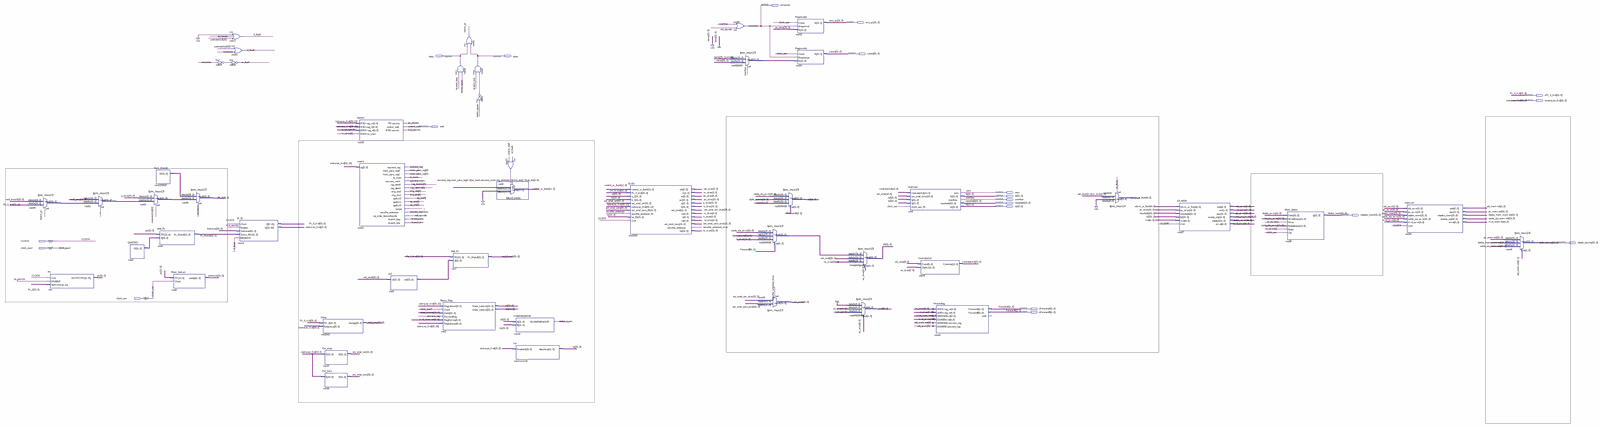
[diagram p0: schematic sheet, whole]
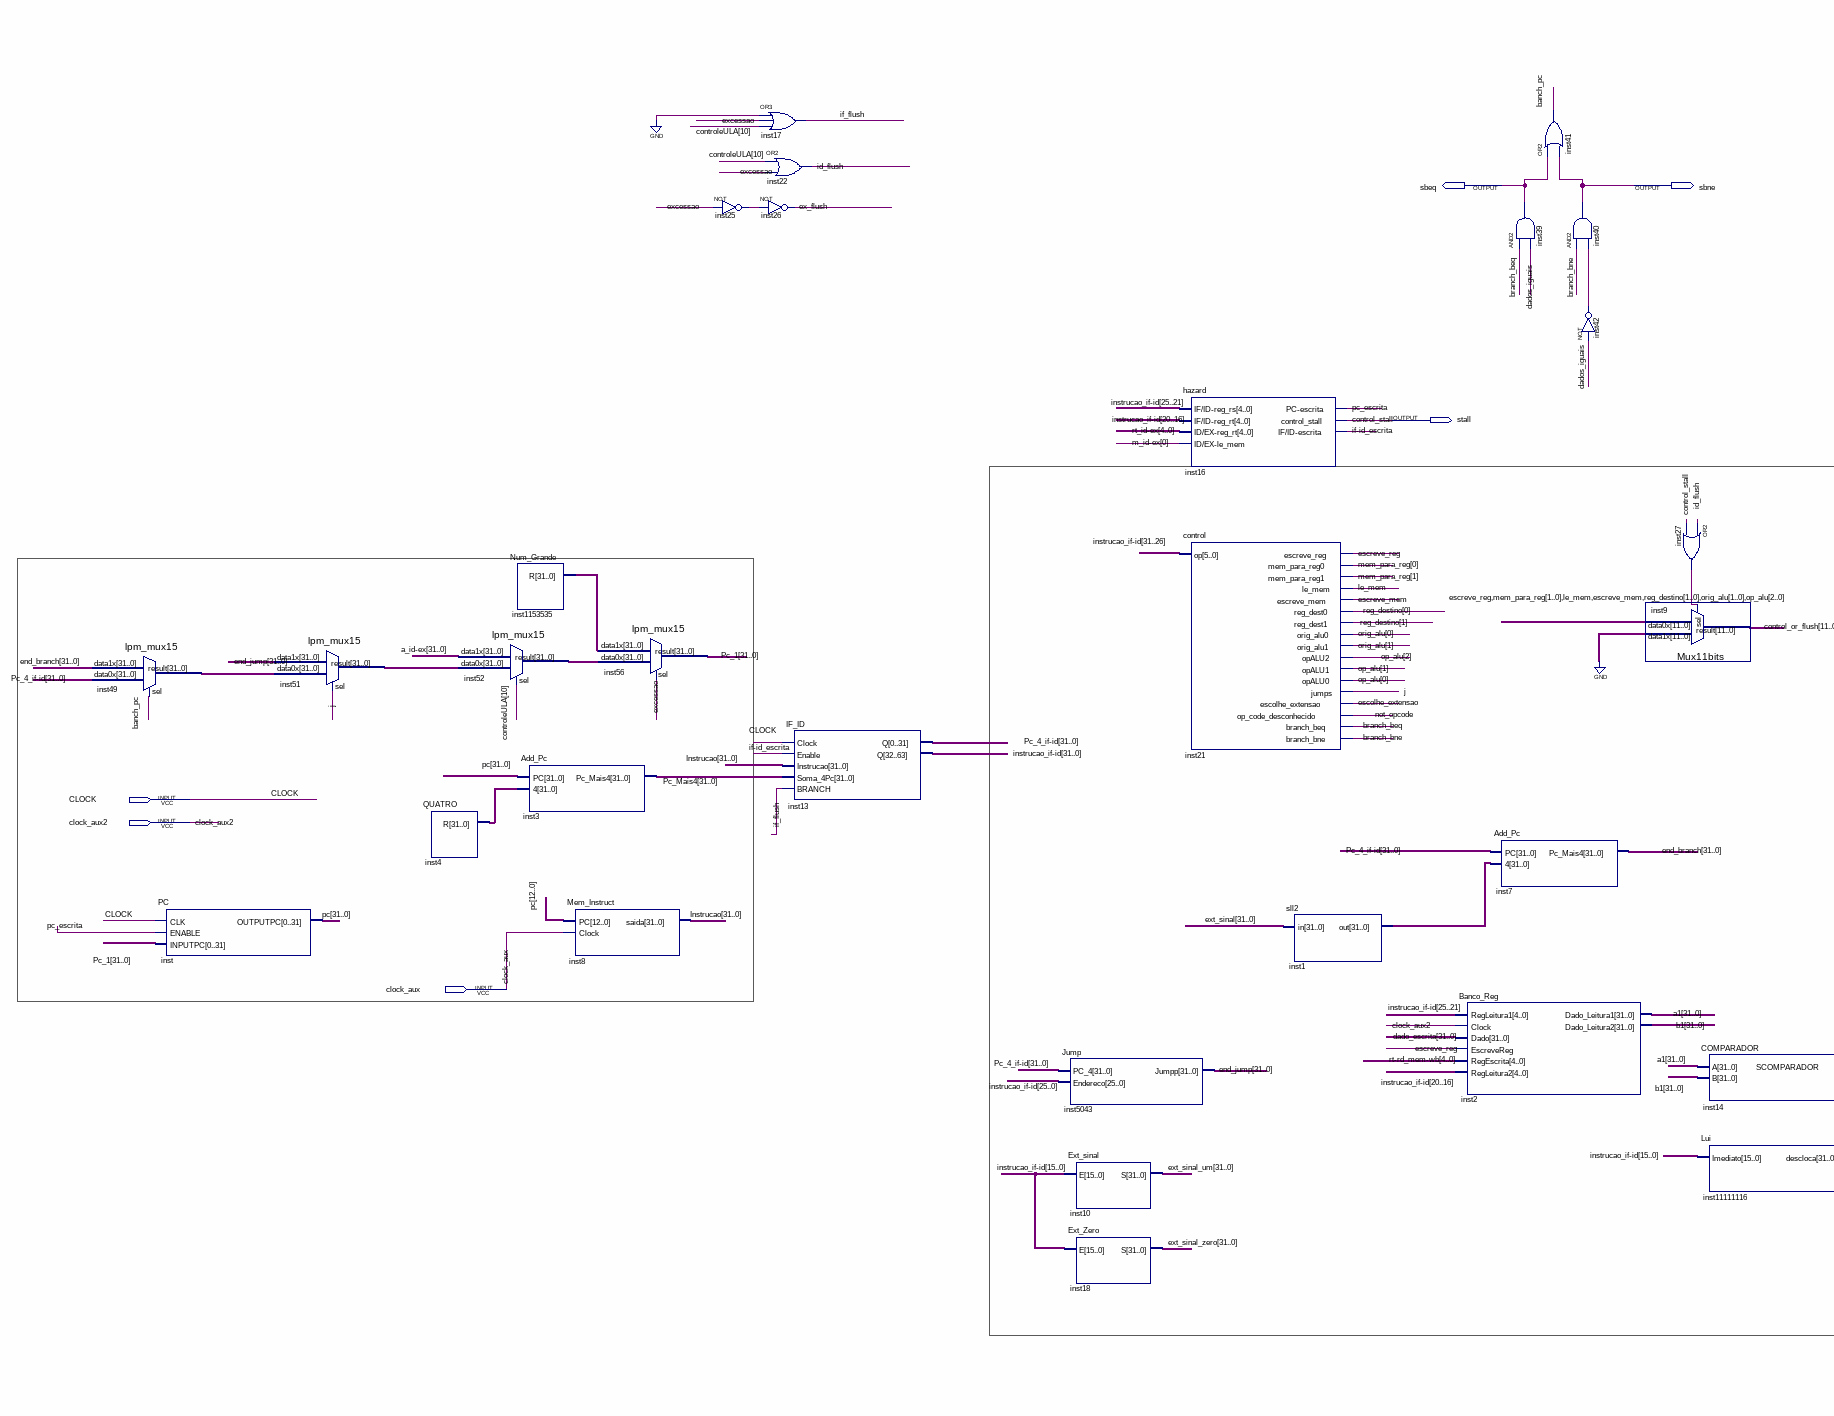
[diagram p1: schematic sheet, left part]
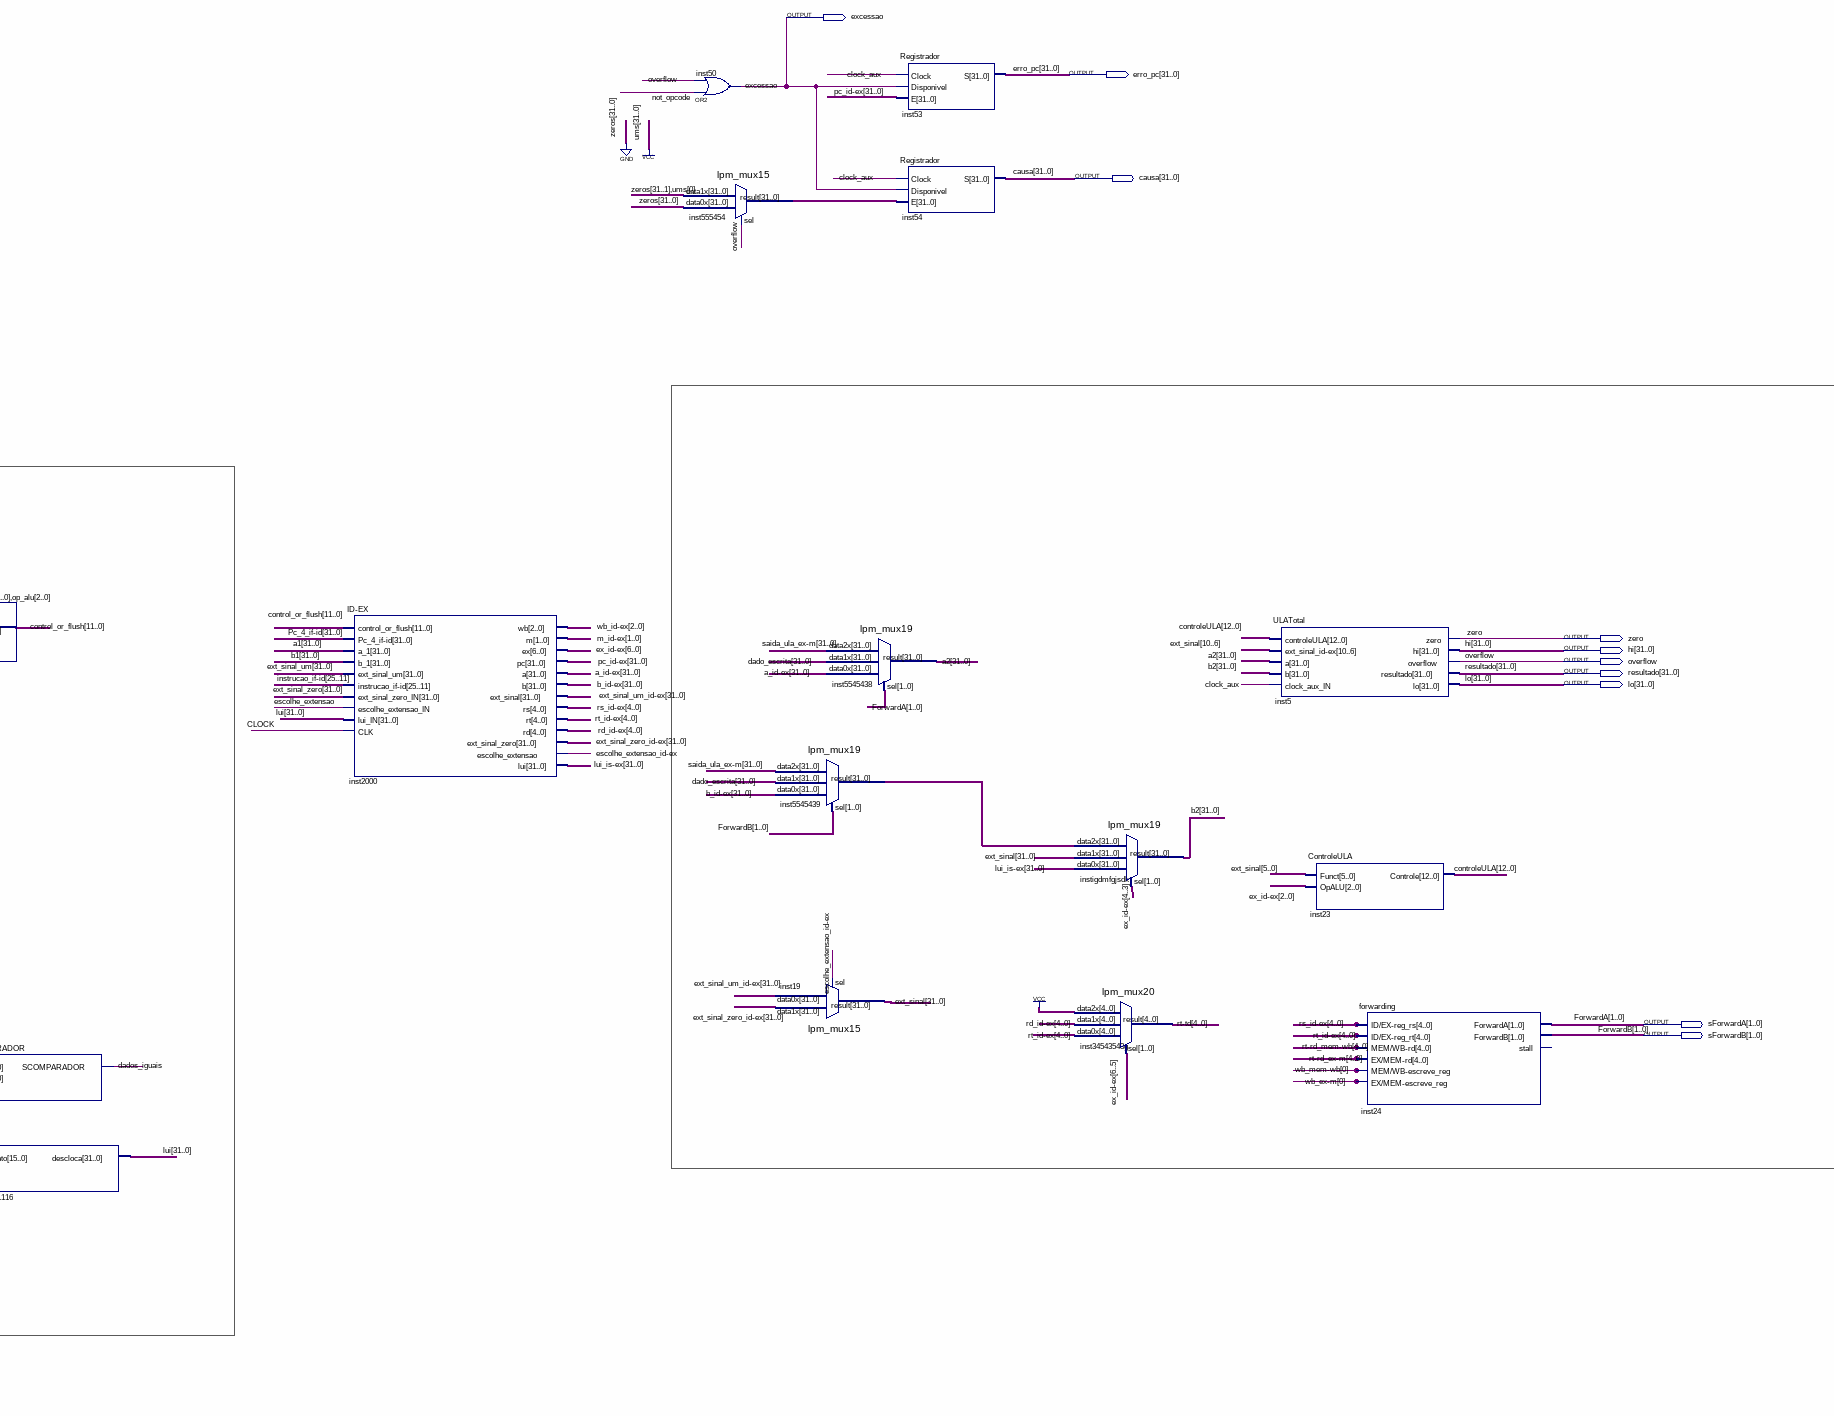
[diagram p2: schematic sheet, centre part]
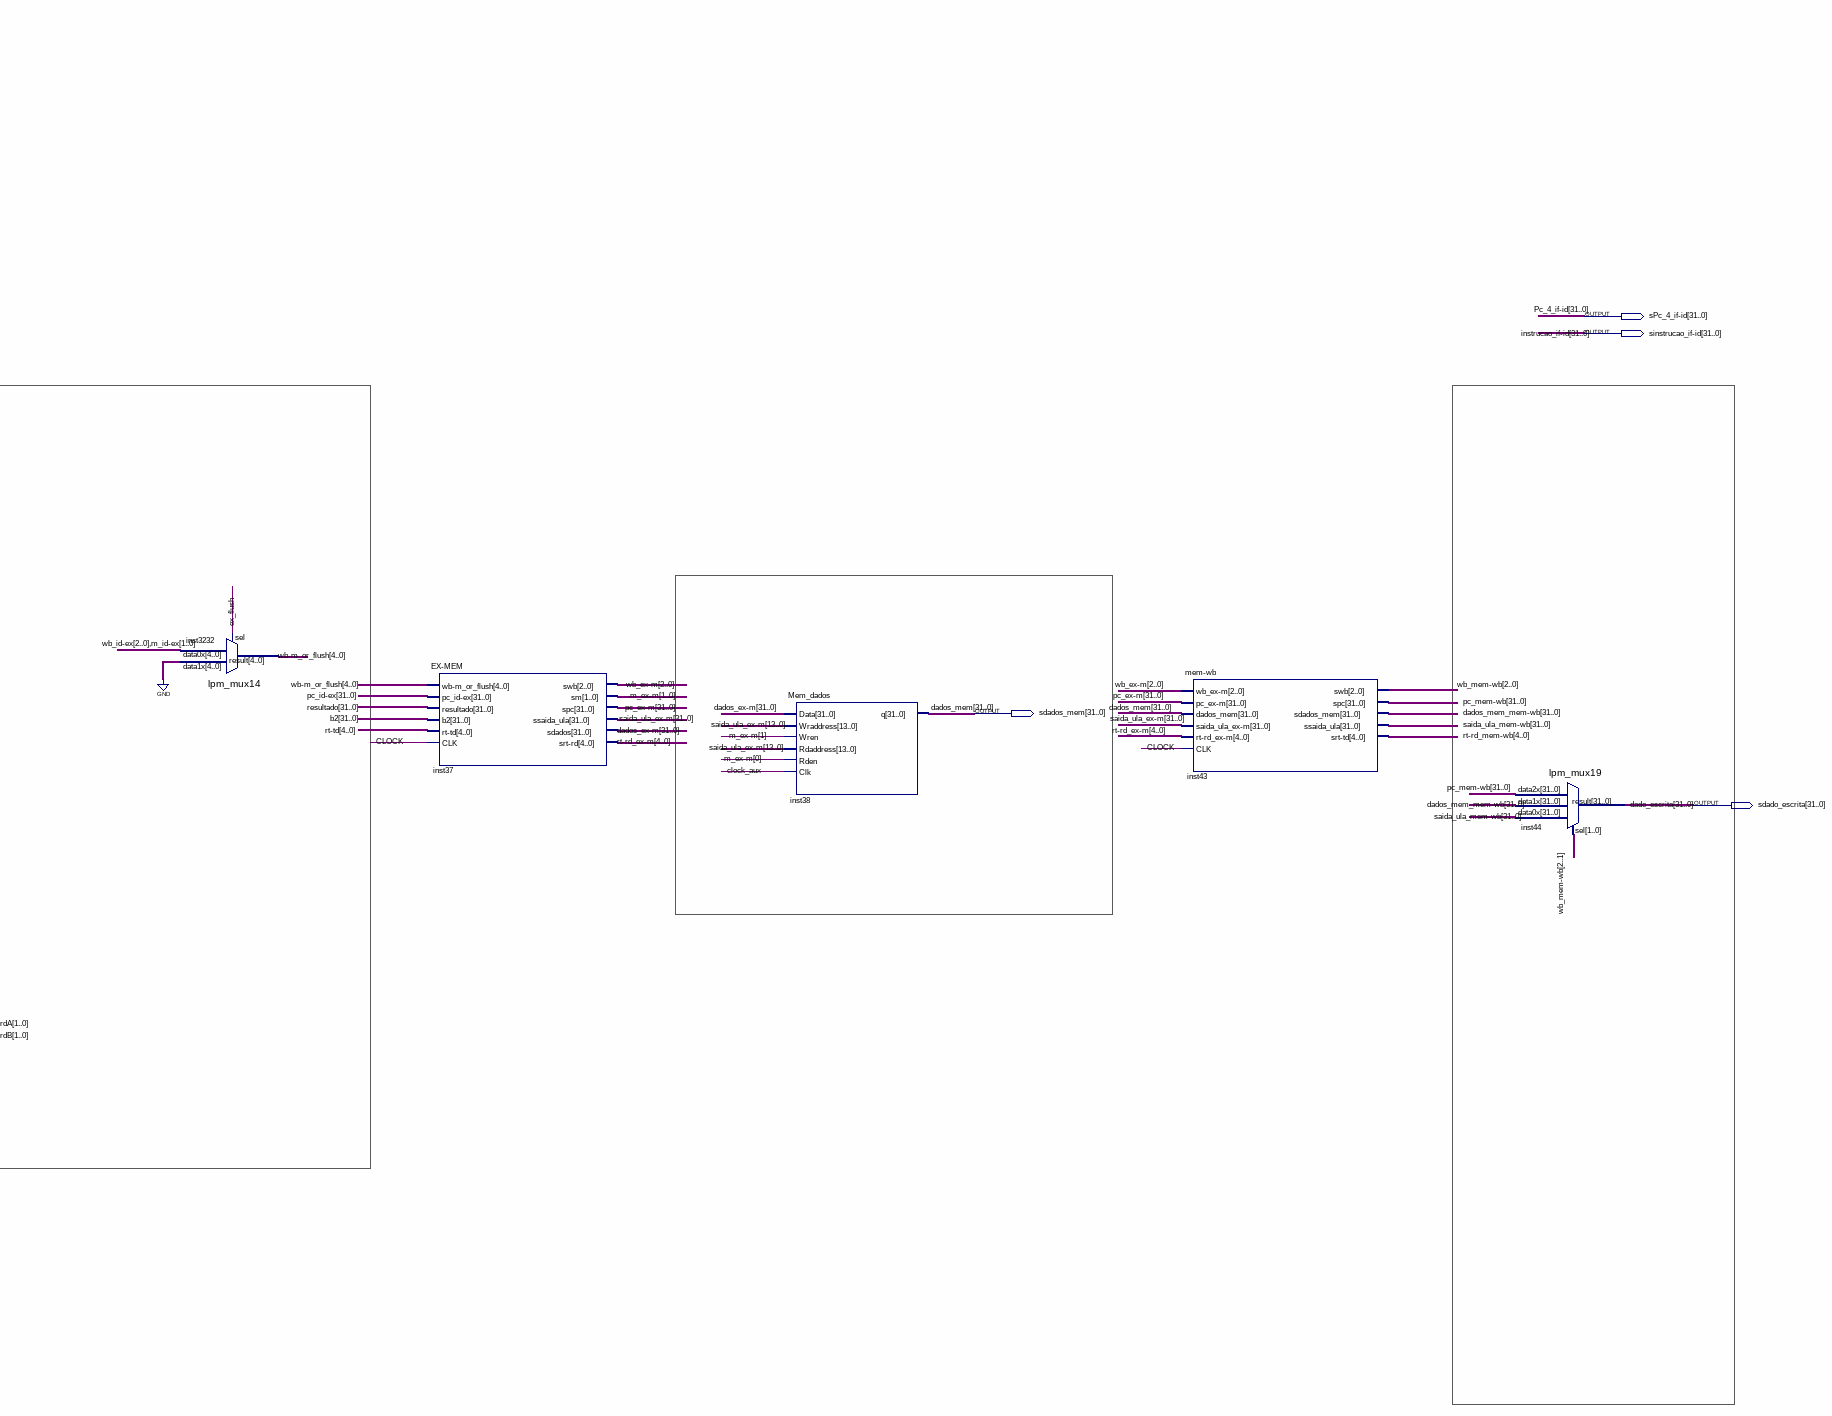
[diagram p3: schematic sheet, right part]
// Quartus schematic tudo.bdf as structural Verilog: 48 symbols, 20 pins
module tudo (
  input  CLOCK,
  input  clock_aux2,
  input  clock_aux,
  output excessao,
  output [31:0] erro_pc,
  output [31:0] causa,
  output sbeq,
  output sbne,
  output [31:0] \sPc_4_if-id ,
  output [31:0] \sinstrucao_if-id ,
  output stall,
  output zero,
  output [31:0] hi,
  output overflow,
  output [31:0] resultado,
  output [31:0] lo,
  output [31:0] sdados_mem,
  output [31:0] sdado_escrita,
  output [1:0] sForwardA,
  output [1:0] sForwardB
);

  wire banch_pc, branch_beq, branch_bne, dados_iguais, escolhe_extensao, \escolhe_extensao_id-ex ,
       escreve_mem, escreve_reg, ex_flush, id_flush, \if-id_escrita , if_flush, inst25_out, inst27_out,
       inst42_out, j, le_mem, not_opcode, pc_escrita;
  wire [1:0] \m_ex-m , \m_id-ex , mem_para_reg, orig_alu, reg_destino;
  wire [2:0] op_alu, \wb_ex-m , \wb_id-ex , \wb_mem-wb ;
  wire [4:0] \rd_id-ex , \rs_id-ex , \rt-rd_ex-m , \rt-rd_mem-wb , \rt-td , \rt_id-ex , \wb-m_or_flush ;
  wire [6:0] \ex_id-ex ;
  wire [11:0] control_or_flush;
  wire [12:0] controleULA;
  wire [31:0] a1, a2, \a_id-ex , b1, b2, \b_id-ex , \dados_ex-m , \dados_mem_mem-wb , end_branch, end_jump,
       ext_sinal, ext_sinal_um, \ext_sinal_um_id-ex , ext_sinal_zero, \ext_sinal_zero_id-ex , inst1_out,
       inst4_r, inst49_result, inst51_result, inst52_result, inst555454_result, inst1153535_r,
       inst5545439_result, Instrucao, lui, \lui_is-ex , pc, Pc_1, \pc_ex-m , \pc_id-ex , Pc_Mais4,
       \pc_mem-wb , \saida_ula_ex-m , \saida_ula_mem-wb ;

  lpm_mux15 inst49 (.data1x(end_branch), .data0x(\sPc_4_if-id ), .result(inst49_result));  // open: sel
  PC inst (.CLK(CLOCK), .ENABLE(pc_escrita), .INPUTPC(Pc_1), .OUTPUTPC(pc));
  lpm_mux15 inst51 (.data1x(end_jump), .data0x(inst49_result), .sel(j), .result(inst51_result));
  QUATRO inst4 (.R(inst4_r));
  lpm_mux15 inst52 (.data1x(\a_id-ex ), .data0x(inst51_result), .sel(controleULA[10]), .result(inst52_result));
  Num_Grande inst1153535 (.R(inst1153535_r));
  Add_Pc inst3 (.PC(pc), .\4 (inst4_r), .Pc_Mais4(Pc_Mais4));
  Mem_Instruct inst8 (.PC(pc[12:0]), .Clock(clock_aux), .saida(Instrucao));
  lpm_mux15 inst56 (.data1x(inst1153535_r), .data0x(inst52_result), .sel(excessao), .result(Pc_1));
  not inst25 (inst25_out, excessao);
  or inst17 (if_flush, 1'b0, excessao, controleULA[10]);
  or inst22 (id_flush, controleULA[10], excessao);
  not inst26 (ex_flush, inst25_out);
  IF_ID inst13 (
    .Clock(CLOCK), .Enable(\if-id_escrita ), .Instrucao(Instrucao), .Soma_4Pc(Pc_Mais4), .BRANCH(if_flush),
    .Q({\sinstrucao_if-id [0], \sinstrucao_if-id [1], \sinstrucao_if-id [2], \sinstrucao_if-id [3], \sinstrucao_if-id [4], \sinstrucao_if-id [5], \sinstrucao_if-id [6], \sinstrucao_if-id [7], \sinstrucao_if-id [8], \sinstrucao_if-id [9], \sinstrucao_if-id [10], \sinstrucao_if-id [11], \sinstrucao_if-id [12], \sinstrucao_if-id [13], \sinstrucao_if-id [14], \sinstrucao_if-id [15], \sinstrucao_if-id [16], \sinstrucao_if-id [17], \sinstrucao_if-id [18], \sinstrucao_if-id [19], \sinstrucao_if-id [20], \sinstrucao_if-id [21], \sinstrucao_if-id [22], \sinstrucao_if-id [23], \sinstrucao_if-id [24], \sinstrucao_if-id [25], \sinstrucao_if-id [26], \sinstrucao_if-id [27], \sinstrucao_if-id [28], \sinstrucao_if-id [29], \sinstrucao_if-id [30], \sinstrucao_if-id [31], \sPc_4_if-id [0], \sPc_4_if-id [1], \sPc_4_if-id [2], \sPc_4_if-id [3], \sPc_4_if-id [4], \sPc_4_if-id [5], \sPc_4_if-id [6], \sPc_4_if-id [7], \sPc_4_if-id [8], \sPc_4_if-id [9], \sPc_4_if-id [10], \sPc_4_if-id [11], \sPc_4_if-id [12], \sPc_4_if-id [13], \sPc_4_if-id [14], \sPc_4_if-id [15], \sPc_4_if-id [16], \sPc_4_if-id [17], \sPc_4_if-id [18], \sPc_4_if-id [19], \sPc_4_if-id [20], \sPc_4_if-id [21], \sPc_4_if-id [22], \sPc_4_if-id [23], \sPc_4_if-id [24], \sPc_4_if-id [25], \sPc_4_if-id [26], \sPc_4_if-id [27], \sPc_4_if-id [28], \sPc_4_if-id [29], \sPc_4_if-id [30], \sPc_4_if-id [31]}));
  Jump inst5043 (.PC_4(\sPc_4_if-id ), .Endereco(\sinstrucao_if-id [25:0]), .Jumpp(end_jump));
  Ext_sinal inst10 (.E(\sinstrucao_if-id [15:0]), .S(ext_sinal_um));
  Ext_Zero inst18 (.E(\sinstrucao_if-id [15:0]), .S(ext_sinal_zero));
  hazard inst16 (
    .\IF/ID-reg_rs (\sinstrucao_if-id [25:21]), .\IF/ID-reg_rt (\sinstrucao_if-id [20:16]),
    .\ID/EX-reg_rt (\rt_id-ex ), .\ID/EX-le_mem (\m_id-ex [0]), .\PC-escrita (pc_escrita),
    .control_stall(stall), .\IF/ID-escrita (\if-id_escrita ));
  control inst21 (
    .op(\sinstrucao_if-id [31:26]), .escreve_reg(escreve_reg), .mem_para_reg0(mem_para_reg[0]),
    .mem_para_reg1(mem_para_reg[1]), .le_mem(le_mem), .escreve_mem(escreve_mem), .reg_dest0(reg_destino[0]),
    .reg_dest1(reg_destino[1]), .orig_alu0(orig_alu[0]), .orig_alu1(orig_alu[1]), .opALU2(op_alu[2]),
    .opALU1(op_alu[1]), .opALU0(op_alu[0]), .jumps(j), .escolhe_extensao(escolhe_extensao),
    .op_code_desconhecido(not_opcode), .branch_beq(branch_beq), .branch_bne(branch_bne));
  sll2 inst1 (.in(ext_sinal), .out(inst1_out));
  Banco_Reg inst2 (
    .RegLeitura1(\sinstrucao_if-id [25:21]), .Clock(clock_aux2), .Dado(sdado_escrita),
    .EscreveReg(escreve_reg), .RegEscrita(\rt-rd_mem-wb ), .RegLeitura2(\sinstrucao_if-id [20:16]),
    .Dado_Leitura1(a1), .Dado_Leitura2(b1));
  and inst39 (sbeq, branch_beq, dados_iguais);
  Add_Pc inst7 (.PC(\sPc_4_if-id ), .\4 (inst1_out), .Pc_Mais4(end_branch));
  or inst41 (banch_pc, sbeq, sbne);
  and inst40 (sbne, branch_bne, inst42_out);
  not inst42 (inst42_out, dados_iguais);
  Mux11bits inst9 (
    .data1x({12{1'b0}}),
    .data0x({escreve_reg, mem_para_reg, le_mem, escreve_mem, reg_destino, orig_alu, op_alu}),
    .sel(inst27_out), .result(control_or_flush));
  or inst27 (inst27_out, id_flush, stall);
  COMPARADOR inst14 (.A(a1), .B(b1), .SCOMPARADOR(dados_iguais));
  Lui inst11111116 (.Imediato(\sinstrucao_if-id [15:0]), .descloca(lui));
  \ID-EX  inst2000 (
    .control_or_flush(control_or_flush), .\Pc_4_if-id (\sPc_4_if-id ), .a_1(a1), .b_1(b1),
    .ext_sinal_um(ext_sinal_um), .\instrucao_if-id (\sinstrucao_if-id [25:11]),
    .ext_sinal_zero_IN(ext_sinal_zero), .escolhe_extensao_IN(escolhe_extensao), .lui_IN(lui), .CLK(CLOCK),
    .wb(\wb_id-ex ), .m(\m_id-ex ), .ex(\ex_id-ex ), .pc(\pc_id-ex ), .a(\a_id-ex ), .b(\b_id-ex ),
    .ext_sinal(\ext_sinal_um_id-ex ), .rs(\rs_id-ex ), .rt(\rt_id-ex ), .rd(\rd_id-ex ),
    .ext_sinal_zero(\ext_sinal_zero_id-ex ), .escolhe_extensao(\escolhe_extensao_id-ex ), .lui(\lui_is-ex ));
  or inst50 (excessao, not_opcode, overflow);
  lpm_mux15 inst555454 (
    .data1x(32'b00000000000000000000000000000001), .data0x({32{1'b0}}), .sel(overflow),
    .result(inst555454_result));
  lpm_mux19 inst5545439 (
    .data2x(\saida_ula_ex-m ), .data1x(sdado_escrita), .data0x(\b_id-ex ), .sel(sForwardB),
    .result(inst5545439_result));
  lpm_mux15 inst19 (
    .data1x(\ext_sinal_zero_id-ex ), .data0x(\ext_sinal_um_id-ex ), .sel(\escolhe_extensao_id-ex ),
    .result(ext_sinal));
  lpm_mux19 inst5545438 (
    .data2x(\saida_ula_ex-m ), .data1x(sdado_escrita), .data0x(\a_id-ex ), .sel(sForwardA), .result(a2));
  Registrador inst53 (.Clock(clock_aux), .Disponivel(excessao), .E(\pc_id-ex ), .S(erro_pc));
  Registrador inst54 (.Clock(clock_aux), .Disponivel(excessao), .E(inst555454_result), .S(causa));
  lpm_mux19 instigdmfgjsdk (
    .data2x(inst5545439_result), .data1x(ext_sinal), .data0x(\lui_is-ex ), .sel(\ex_id-ex [4:3]), .result(b2));
  lpm_mux20 inst34543543g (
    .data2x({5{1'b1}}), .data1x(\rd_id-ex ), .data0x(\rt_id-ex ), .sel(\ex_id-ex [6:5]), .result(\rt-td ));
  ULATotal inst5 (
    .controleULA(controleULA), .\ext_sinal_id-ex (ext_sinal[10:6]), .a(a2), .b(b2), .clock_aux_IN(clock_aux),
    .zero(zero), .hi(hi), .overflow(overflow), .resultado(resultado), .lo(lo));
  ControleULA inst23 (.Funct(ext_sinal[5:0]), .OpALU(\ex_id-ex [2:0]), .Controle(controleULA));
  forwarding inst24 (
    .\ID/EX-reg_rs (\rs_id-ex ), .\ID/EX-reg_rt (\rt_id-ex ), .\MEM/WB-rd (\rt-rd_mem-wb ),
    .\EX/MEM-rd (\rt-rd_ex-m ), .\MEM/WB-escreve_reg (\wb_mem-wb [0]), .\EX/MEM-escreve_reg (\wb_ex-m [0]),
    .ForwardA(sForwardA), .ForwardB(sForwardB));  // open: stall
  lpm_mux14 inst3232 (.data1x({5{1'b0}}), .data0x({\wb_id-ex , \m_id-ex }), .sel(ex_flush), .result(\wb-m_or_flush ));
  \EX-MEM  inst37 (
    .\wb-m_or_flush (\wb-m_or_flush ), .\pc_id-ex (\pc_id-ex ), .resultado(resultado), .b2(b2),
    .\rt-td (\rt-td ), .CLK(CLOCK), .swb(\wb_ex-m ), .sm(\m_ex-m ), .spc(\pc_ex-m ),
    .ssaida_ula(\saida_ula_ex-m ), .sdados(\dados_ex-m ), .\srt-rd (\rt-rd_ex-m ));
  Mem_dados inst38 (
    .Data(\dados_ex-m ), .Wraddress(\saida_ula_ex-m [13:0]), .Wren(\m_ex-m [1]),
    .Rdaddress(\saida_ula_ex-m [13:0]), .Rden(\m_ex-m [0]), .Clk(clock_aux), .q(sdados_mem));
  \mem-wb  inst43 (
    .\wb_ex-m (\wb_ex-m ), .\pc_ex-m (\pc_ex-m ), .dados_mem(sdados_mem),
    .\saida_ula_ex-m (\saida_ula_ex-m ), .\rt-rd_ex-m (\rt-rd_ex-m ), .CLK(CLOCK), .swb(\wb_mem-wb ),
    .spc(\pc_mem-wb ), .sdados_mem(\dados_mem_mem-wb ), .ssaida_ula(\saida_ula_mem-wb ),
    .\srt-td (\rt-rd_mem-wb ));
  lpm_mux19 inst44 (
    .data2x(\pc_mem-wb ), .data1x(\dados_mem_mem-wb ), .data0x(\saida_ula_mem-wb ), .sel(\wb_mem-wb [2:1]),
    .result(sdado_escrita));

  // Other names for the same wires on the sheet: control_stall = stall; dado_escrita[31:0] = sdado_escrita;
  //   dados_mem[31:0] = sdados_mem; ForwardA[1:0] = sForwardA; ForwardB[1:0] = sForwardB;
  //   instrucao_if-id[31:0] = \sinstrucao_if-id ; Pc_4_if-id[31:0] = \sPc_4_if-id 
endmodule
